# EasyEDA Pro project AC Power Switch.eprj, board PCB2
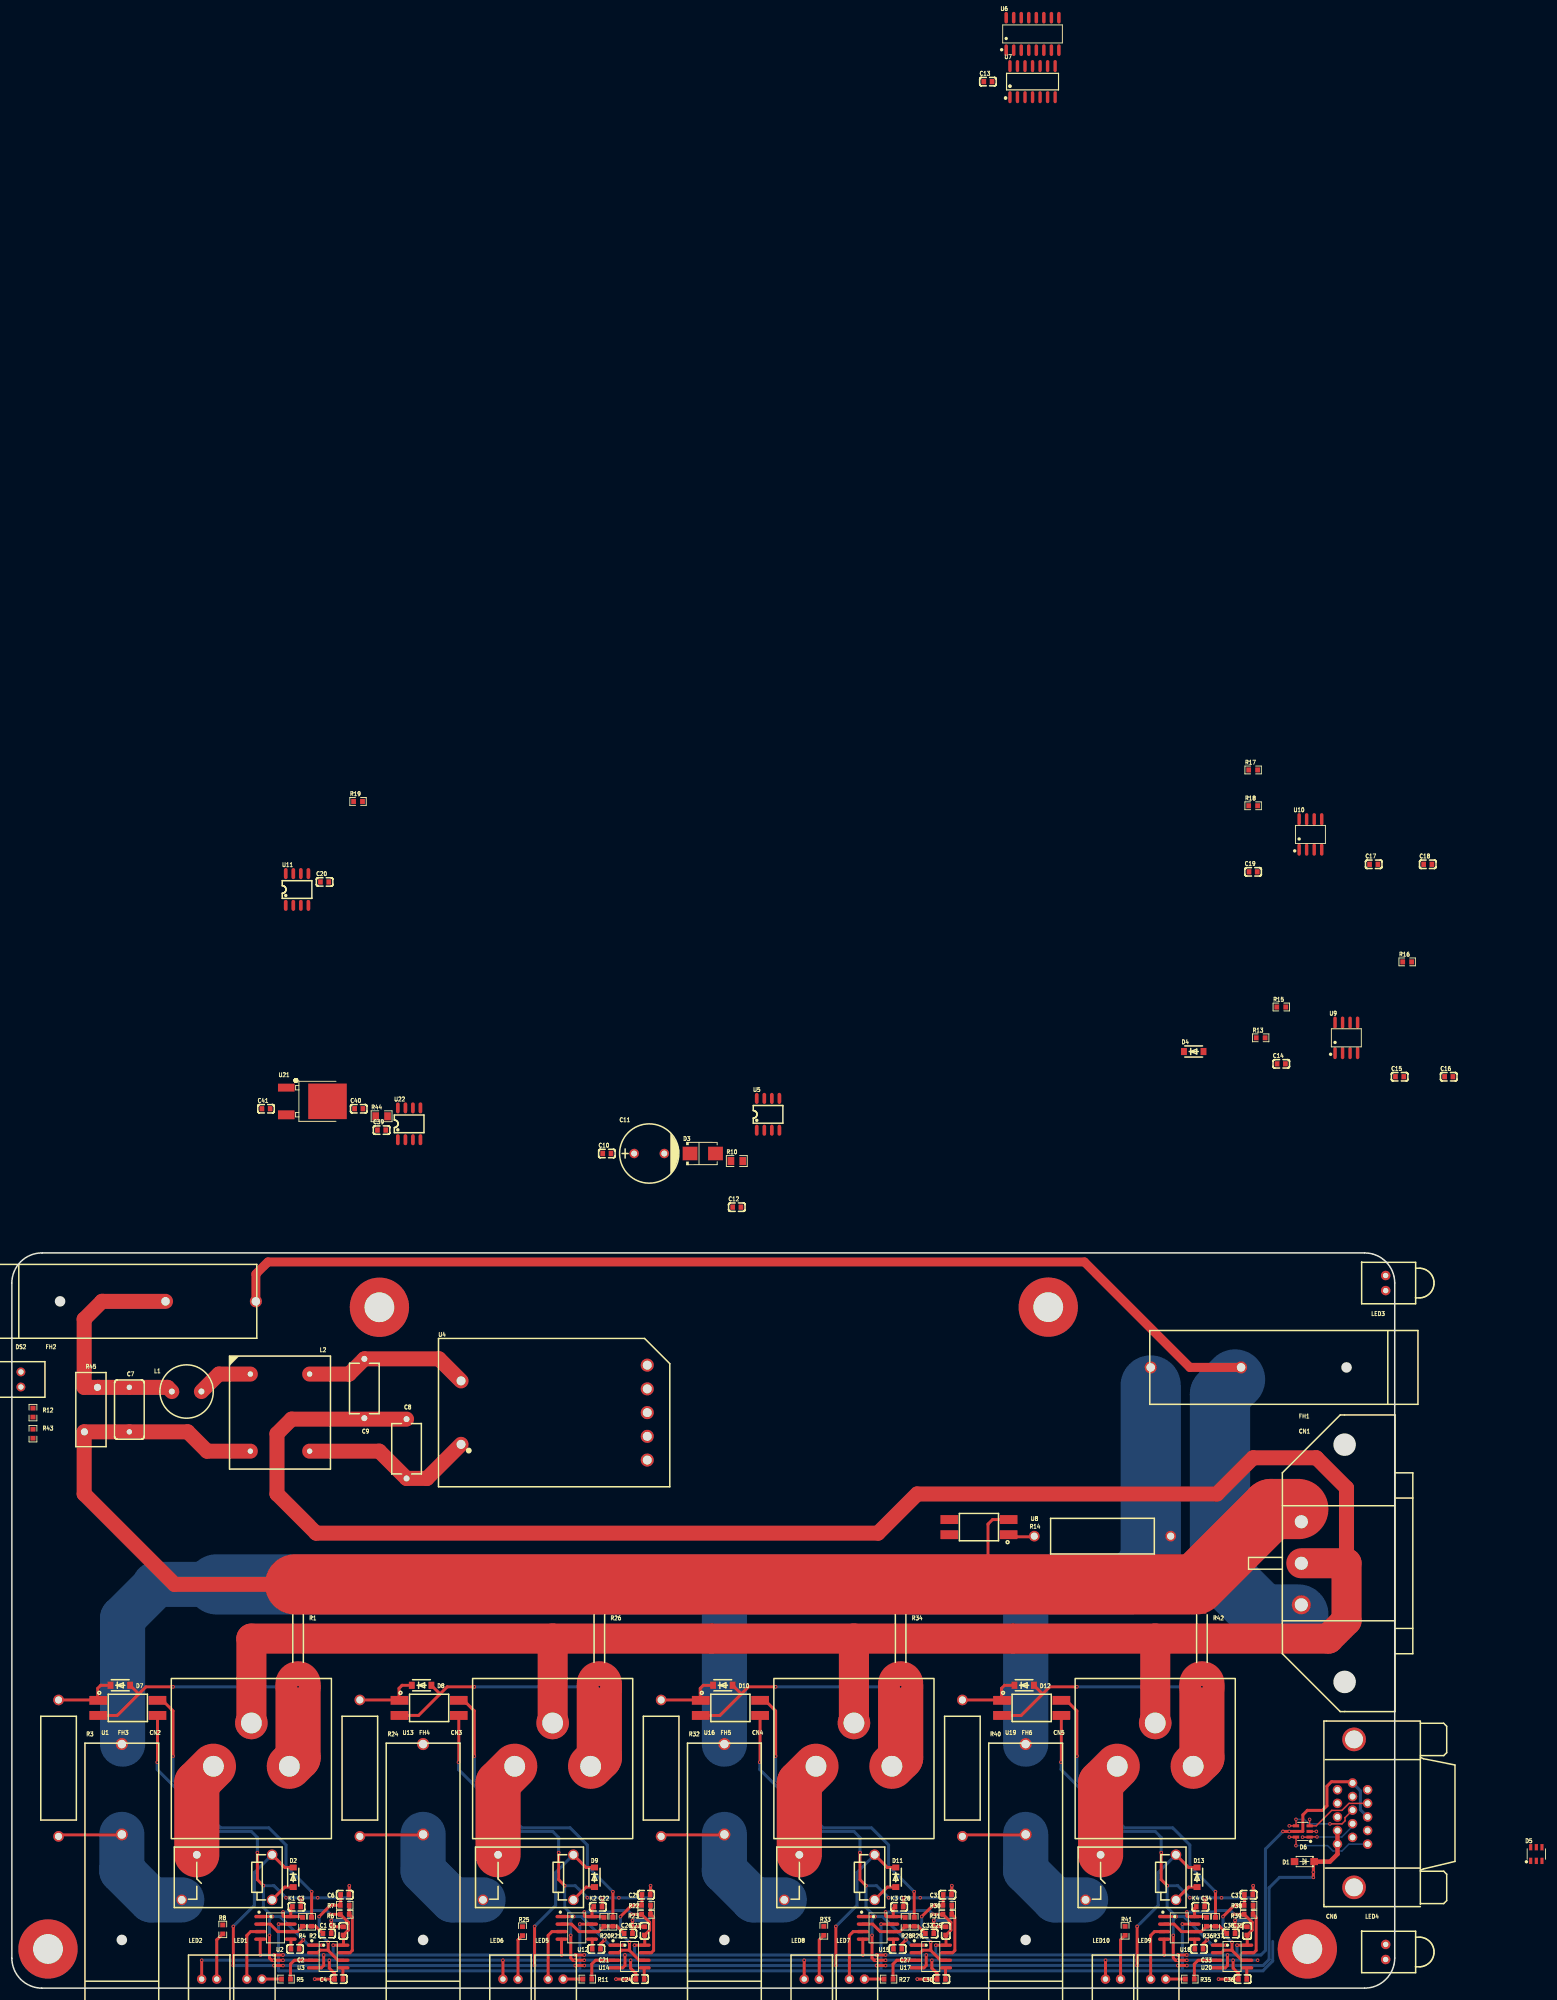
[diagram p7: board, top side]
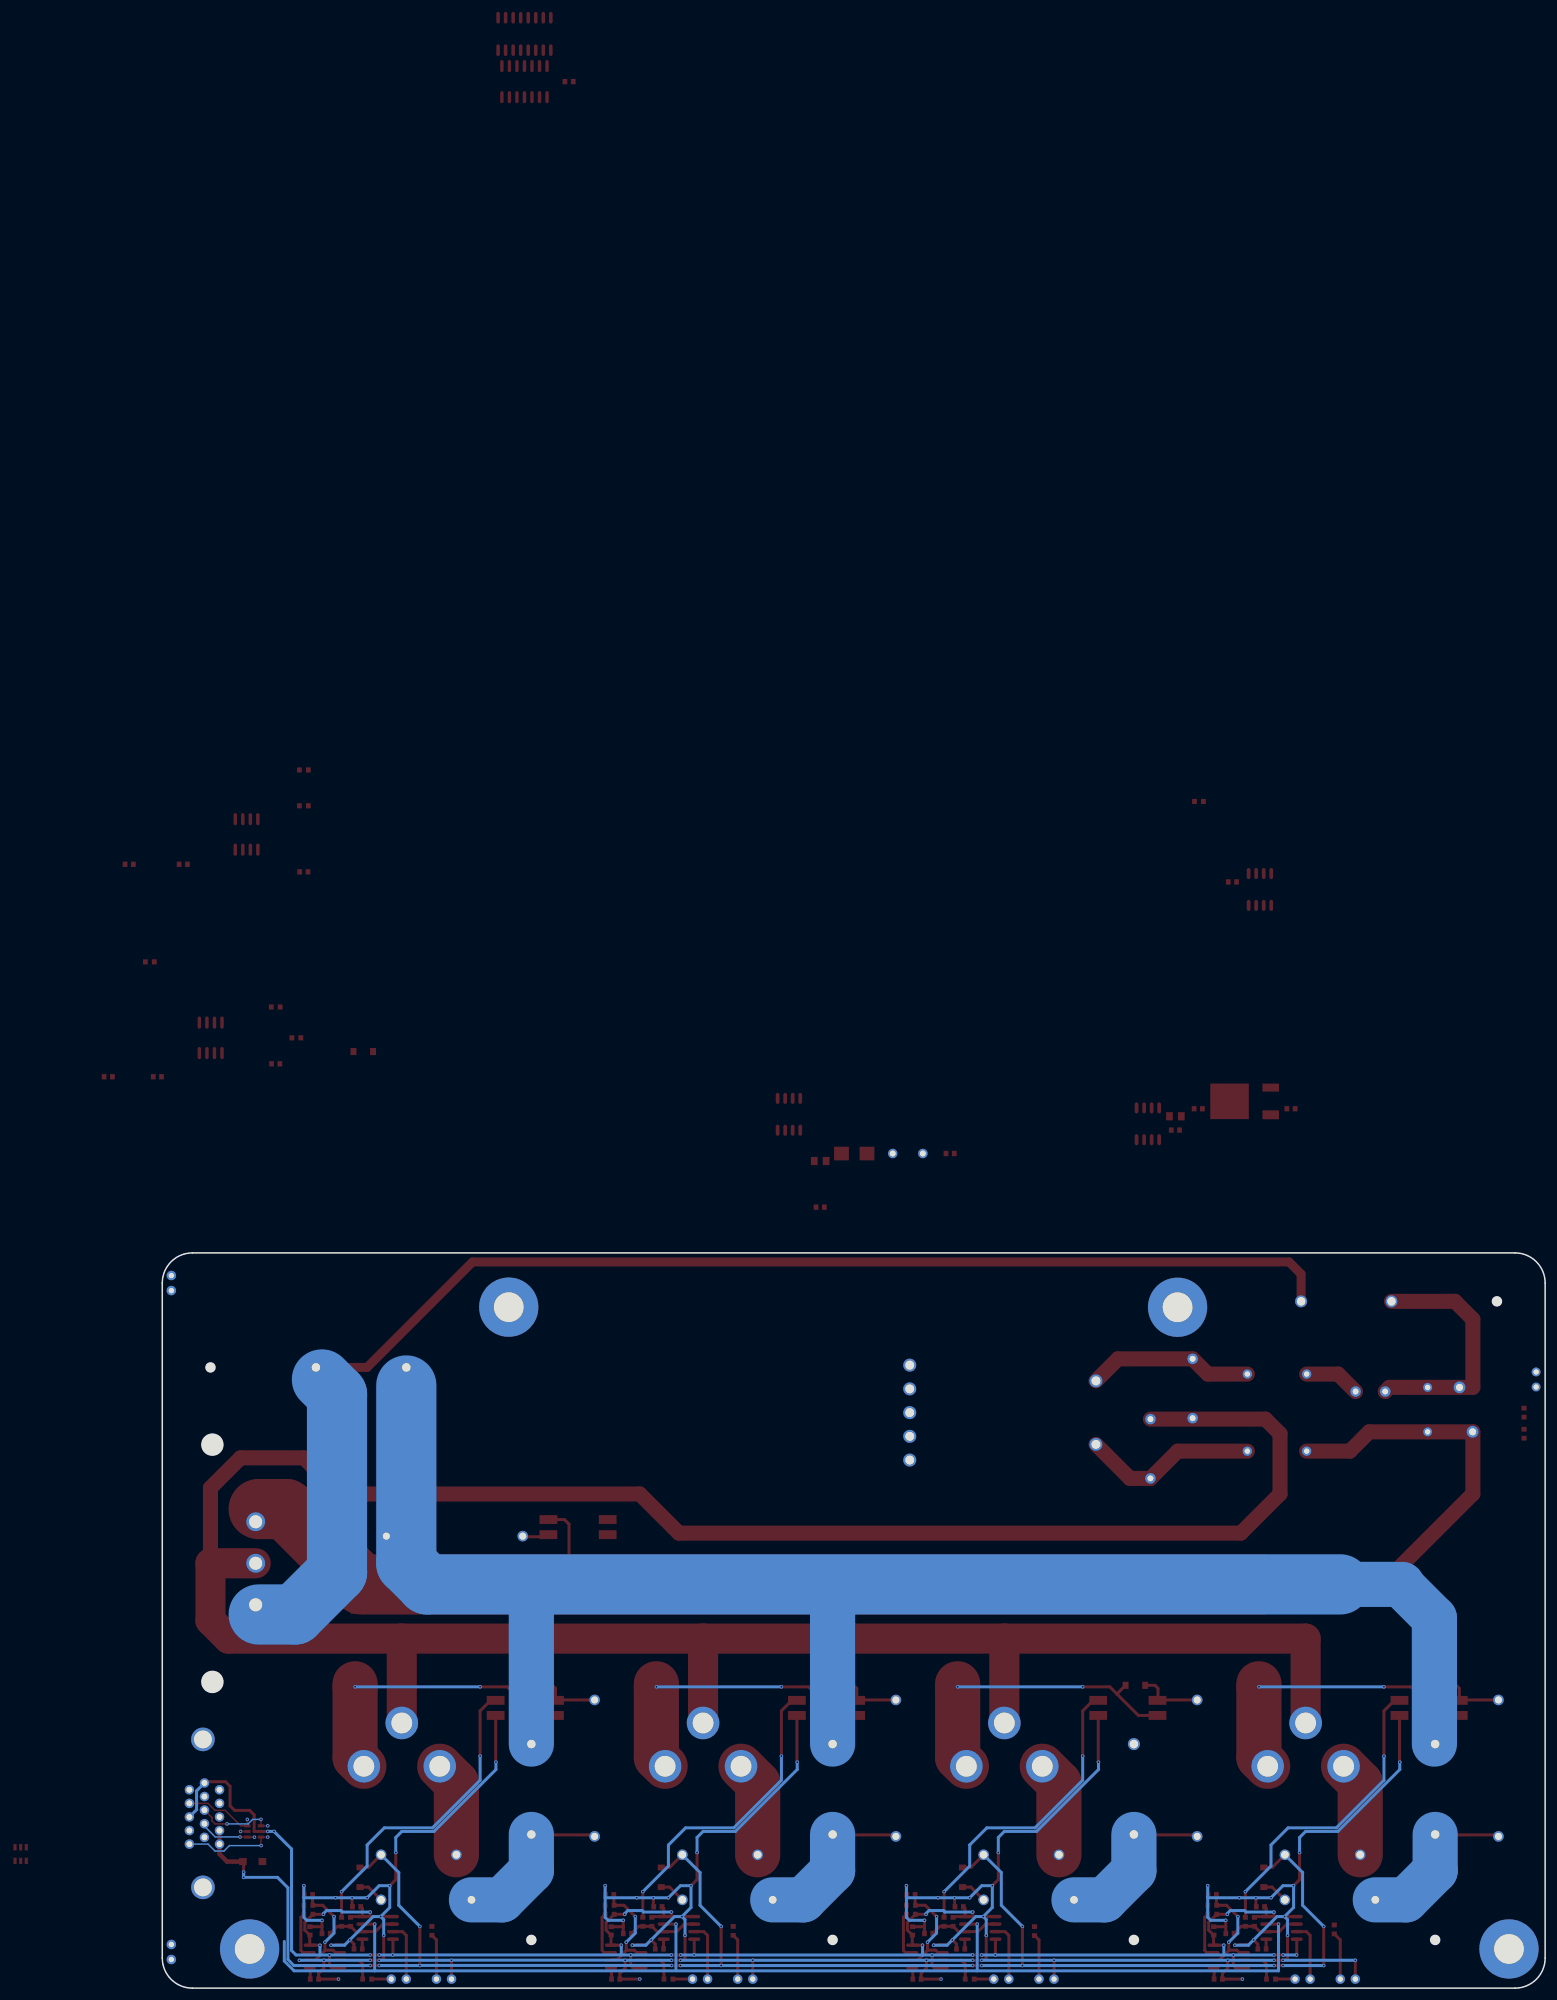
[diagram p8: board, bottom side, seen from below]

Outline 233.17 x 123.95 mm; copper layers: Top Layer, Bottom Layer. Coordinates in mm from the lower left corner of the outline.
Outline path: 0,118.87 0,5.08 arc(1.49,1.49) 5.08,0 228.09,0 arc(231.68,1.49) 233.17,5.08 233.17,118.87 arc(231.68,122.46) 228.09,123.95 5.08,123.95 arc(1.49,122.46) 0,118.87
Stack: Top Layer 0.035mm / Dielectric1 1.51mm FR4 er 4.5 / Bottom Layer 0.035mm

## Design rules (mm)
template: Custom Config
spacing copperThickness1oz (default): track to track 0.102, other pairs 0.152 to 0.3
spacing copperThickness2oz: track to track 0.203, other pairs 0.152 to 0.3
track width copperThickness1oz (default): min 0.127, default 0.254, max 10.16
track width copperThickness2oz: min 0.203, default 0.254, max 2.54
differential pair differentialPair (default): width min 0.127, default 0.254, max 2.54; gap min 0.152, default 0.152
via viaSize (default): diameter min 0.5, default 0.61, max 10; hole min 0.3, default 0.305, max 6.3

## Placement (name value [footprint] x y rotation side)
C1  -  [C0603]  53.15 9.21 180 top
C2  -  [C0603]  47.75 6.6 180 top
C3  -  [C0603]  48.01 13.72 180 top
C4  -  [C0603]  55.12 1.52 0 top
C5  -  [C0603]  55.88 9.65 270 top
C6  -  [C0603]  56.13 15.75 180 top
C7  100nF  [CAP-TH_L10.0-W5.0-P7.50-D0.6]  19.81 97.54 270 top
C8  1nF  [CAP-TH_L8.5-W5.0-P10.00-D0.6]  66.55 90.93 270 top
C9  1nF  [CAP-TH_L8.5-W5.0-P10.00-D0.6]  59.44 101.09 270 top
C10  1uF  [C0603]  100.33 140.71 0 top
C11  470uF  [CAP-TH_BD10.0-P5.00-D1.0-FD]  107.47 140.71 0 top
C12  100nF  [C0603]  122.24 131.67 0 top
C13  100nF  [C0603]  164.58 321.42 0 top
C14  10uF  [C0603]  214.04 155.83 0 top
C15  100nF  [C0603]  234 153.66 0 top
C16  100nF  [C0603]  242.28 153.66 0 top
C17  100nF  [C0603]  229.63 189.47 0 top
C18  100nF  [C0603]  238.75 189.47 0 top
C19  10uF  [C0603]  209.3 188.2 0 top
C20  100nF  [C0603]  52.73 186.5 0 top
C21  -  [C0603]  98.55 6.6 180 top
C22  -  [C0603]  98.81 13.72 180 top
C23  -  [C0603]  106.68 9.65 270 top
C24  -  [C0603]  105.92 1.52 0 top
C25  -  [C0603]  106.93 15.75 180 top
C26  -  [C0603]  103.95 9.21 180 top
C27  -  [C0603]  149.35 6.6 180 top
C28  -  [C0603]  149.61 13.72 180 top
C29  -  [C0603]  157.48 9.65 270 top
C30  -  [C0603]  156.72 1.52 0 top
C31  -  [C0603]  157.73 15.75 180 top
C32  -  [C0603]  154.75 9.21 180 top
C33  -  [C0603]  200.15 6.6 180 top
C34  -  [C0603]  200.41 13.72 180 top
C35  -  [C0603]  208.28 9.65 270 top
C36  -  [C0603]  207.52 1.52 0 top
C37  -  [C0603]  208.53 15.75 180 top
C38  -  [C0603]  205.55 9.21 180 top
C39  100nF  [C0603]  62.34 144.66 0 top
C40  100nF  [C0603]  58.49 148.26 0 top
C41  1uF  [C0603]  42.85 148.26 0 top
CN1  IEC-EW-4  [CONN-TH_IEC-EW-4]  217.42 71.63 270 top
CN2  -  [739W-X2/32]  40.39 44.7 0 top
CN3  -  [739W-X2/32]  91.19 44.7 0 top
CN4  -  [739W-X2/32]  141.99 44.7 0 top
CN5  -  [739W-X2/32]  192.79 44.7 0 top
CN6  DS1038-15FBNSiA74-0CC  [DSUB-TH_DS1038-15FBNSIA74-0CC]  226.06 29.46 90 top
D1  SMF12A  [SOD-123FL_L2.8-W1.8-LS3.8-R-RD]  217.93 21.34 180 top
D2  -  [SOD-123F_L2.8-W1.8-LS3.7-RD]  47.44 18.69 270 top
D3  SMBJ15A  [SMB_L4.3-W3.6-LS5.3-RD]  116.5 140.71 0 top
D4  SM4007PL  [SOD-123F_L2.8-W1.8-LS3.7-RD]  199.28 157.9 0 top
D5  SRV05-4  [SOT-23-6_L2.9-W1.6-P0.95-LS2.8-BL]  257.05 22.61 0 top
D6  SRV05-4  [SOT-23-6_L2.9-W1.6-P0.95-LS2.8-BL]  217.68 26.42 90 top
D7  -  [SOD-123F_L2.8-W1.8-LS3.7-RD]  18.29 51.05 0 top
D8  -  [SOD-123F_L2.8-W1.8-LS3.7-RD]  69.09 51.05 0 top
D9  -  [SOD-123F_L2.8-W1.8-LS3.7-RD]  98.24 18.69 270 top
D10  -  [SOD-123F_L2.8-W1.8-LS3.7-RD]  119.89 51.05 0 top
D11  -  [SOD-123F_L2.8-W1.8-LS3.7-RD]  149.04 18.69 270 top
D12  -  [SOD-123F_L2.8-W1.8-LS3.7-RD]  170.69 51.05 0 top
D13  -  [SOD-123F_L2.8-W1.8-LS3.7-RD]  199.84 18.69 270 top
DS2  MHK1560UGBTD  [LED-TH_MHK1560UGBTD]  1.52 102.62 270 top
FH1  -  [03450101H]  199.64 104.65 180 top
FH2  -  [03450101H]  33.53 115.79 0 top
FH3  -  [03450101H]  18.54 33.53 90 top
FH4  -  [03450101H]  69.34 33.53 90 top
FH5  -  [03450101H]  120.14 33.53 90 top
FH6  -  [03450101H]  170.94 33.53 90 top
K1  -  [RELAY-TH_QLRELAY_JZC-11FH-XXX-1H1L]  36.26 18.69 180 top
K2  -  [RELAY-TH_QLRELAY_JZC-11FH-XXX-1H1L]  87.06 18.69 180 top
K3  -  [RELAY-TH_QLRELAY_JZC-11FH-XXX-1H1L]  137.86 18.69 180 top
K4  -  [RELAY-TH_QLRELAY_JZC-11FH-XXX-1H1L]  188.66 18.69 180 top
L1  470uH  [IND-TH_BD9.0-P5.00-D0.7]  29.46 100.58 0 top
L2  YDUU10.5-253L0321  [IND-TH_4P-L19.0-W17.0]  45.21 97.03 270 top
LED1  -  [LED-TH_L12.2-W6.0-P2.54]  40.89 1.52 0 top
LED2  -  [LED-TH_L12.2-W6.0-P2.54]  33.27 1.52 0 top
LED3  MHK1560CRBTD  [LED-TH_L12.2-W6.0-P2.54]  231.65 118.87 90 top
LED4  MHK1560CRBTD  [LED-TH_L12.2-W6.0-P2.54]  231.65 6.1 90 top
LED5  -  [LED-TH_L12.2-W6.0-P2.54]  91.69 1.52 0 top
LED6  -  [LED-TH_L12.2-W6.0-P2.54]  84.07 1.52 0 top
LED7  -  [LED-TH_L12.2-W6.0-P2.54]  142.49 1.52 0 top
LED8  -  [LED-TH_L12.2-W6.0-P2.54]  134.87 1.52 0 top
LED9  -  [LED-TH_L12.2-W6.0-P2.54]  193.29 1.52 0 top
LED10  -  [LED-TH_L12.2-W6.0-P2.54]  185.67 1.52 0 top
NOREF  -  [Pad_e1205]  6.1 6.6 0 top
NOREF#2  -  [Pad_e1190]  174.75 114.81 0 top
NOREF#3  -  [Pad_e1191]  61.98 114.79 0 top
NOREF#4  -  [Pad_e1171]  218.44 6.6 0 top
R1  -  [RES-SMD_L10.2-W1.5_HOTCU-10.2D-0R]  48.26 58.93 270 top
R2  -  [R0603]  50.55 11.18 270 top
R3  -  [RES-TH_BD6.0-L17.5-P21.50-D0.8]  7.87 37.08 270 top
R4  -  [R0603]  49.02 11.18 90 top
R5  -  [R0603]  46.23 1.52 0 top
R6  -  [R0603]  56.13 12.45 180 top
R7  -  [R0603]  56.13 13.97 0 top
R8  -  [R0603]  35.56 9.9 90 top
R10  390Ω  [R0805]  122.24 139.44 0 top
R11  -  [R0603]  97.03 1.52 0 top
R12  1kΩ  [R0603]  3.56 97.03 90 top
R13  100Ω  [R0603]  210.57 160.21 0 top
R14  33kΩ  [RES-TH_BD6.0-L17.5-P21.50-D0.8]  183.9 76.2 0 top
R15  4.7kΩ  [R0603]  214.04 165.41 0 top
R16  1kΩ  [R0603]  235.27 173.02 0 top
R17  10kΩ  [R0603]  209.3 205.37 0 top
R18  20kΩ  [R0603]  209.3 199.34 0 top
R19  1kΩ  [R0603]  58.37 200.07 0 top
R20  -  [R0603]  99.82 11.18 90 top
R21  -  [R0603]  101.35 11.18 270 top
R22  -  [R0603]  106.93 13.97 0 top
R23  -  [R0603]  106.93 12.45 180 top
R24  -  [RES-TH_BD6.0-L17.5-P21.50-D0.8]  58.67 37.08 270 top
R25  -  [R0603]  86.1 9.61 90 top
R26  -  [RES-SMD_L10.2-W1.5_HOTCU-10.2D-0R]  99.06 58.93 270 top
R27  -  [R0603]  147.83 1.52 0 top
R28  -  [R0603]  150.62 11.18 90 top
R29  -  [R0603]  152.15 11.18 270 top
R30  -  [R0603]  157.73 13.97 0 top
R31  -  [R0603]  157.73 12.45 180 top
R32  -  [RES-TH_BD6.0-L17.5-P21.50-D0.8]  109.47 37.08 270 top
R33  -  [R0603]  136.91 9.65 90 top
R34  -  [RES-SMD_L10.2-W1.5_HOTCU-10.2D-0R]  149.86 58.93 270 top
R35  -  [R0603]  198.63 1.52 0 top
R36  -  [R0603]  201.42 11.18 90 top
R37  -  [R0603]  202.95 11.18 270 top
R38  -  [R0603]  208.53 13.97 0 top
R39  -  [R0603]  208.53 12.45 180 top
R40  -  [RES-TH_BD6.0-L17.5-P21.50-D0.8]  160.27 37.08 270 top
R41  -  [R0603]  187.71 9.65 90 top
R42  -  [RES-SMD_L10.2-W1.5_HOTCU-10.2D-0R]  200.66 58.93 270 top
R43  1kΩ  [R0603]  3.56 93.47 90 top
R44  390Ω  [R0805]  62.34 146.99 0 top
R45  210pF@1kHz  [RES-TH_L12.5-W5.1-P7.50-D1.2-S2.20]  13.34 97.54 270 top
U1  -  [OPTO-SMD-4_L4.6-W6.5-P2.54-LS10.3-BL]  19.56 47.24 270 top
U2  -  [SOIC-8_L4.9-W3.9-P1.27-LS6.0-BL]  44.45 10.16 270 top
U3  -  [SOIC-8_L4.9-W3.9-P1.27-LS6.0-BL]  53.34 5.33 270 top
U4  TAS20-12-W2  [PWRM-TH_4P-L39.0-W25.0_TAS12-15-W2]  91.44 97.03 0 top
U5  MX5052S  [SOP-8_L4.9-W3.9-P1.27-LS6.0-BL]  127.51 147.32 0 top
U6  ULN2003ADR  [SOIC-16_L9.9-W3.9-P1.27-LS6.0-BL]  172.1 329.46 0 top
U7  74HC08D,653  [SOIC-14_L8.7-W3.9-P1.27-LS6.0-BL]  172.1 321.42 0 top
U8  LTV-817S-TA1-C  [OPTO-SMD-4_L4.6-W6.5-P2.54-LS10.3-BL]  163.07 77.72 90 top
U9  NE555DR  [SOIC-8_L4.9-W3.9-P1.27-LS6.0-BL]  225.01 160.21 0 top
U10  NE555DR  [SOIC-8_L4.9-W3.9-P1.27-LS6.0-BL]  218.96 194.51 0 top
U11  DS18B20Z(UMW)  [SOP-8_L4.9-W3.9-P1.27-LS6.0-BL]  48.09 185.23 0 top
U12  -  [SOIC-8_L4.9-W3.9-P1.27-LS6.0-BL]  95.25 10.16 270 top
U13  -  [OPTO-SMD-4_L4.6-W6.5-P2.54-LS10.3-BL]  70.36 47.24 270 top
U14  -  [SOIC-8_L4.9-W3.9-P1.27-LS6.0-BL]  104.14 5.33 270 top
U15  -  [SOIC-8_L4.9-W3.9-P1.27-LS6.0-BL]  146.05 10.16 270 top
U16  -  [OPTO-SMD-4_L4.6-W6.5-P2.54-LS10.3-BL]  121.16 47.24 270 top
U17  -  [SOIC-8_L4.9-W3.9-P1.27-LS6.0-BL]  154.94 5.33 270 top
U18  -  [SOIC-8_L4.9-W3.9-P1.27-LS6.0-BL]  196.85 10.16 270 top
U19  -  [OPTO-SMD-4_L4.6-W6.5-P2.54-LS10.3-BL]  171.96 47.24 270 top
U20  -  [SOIC-8_L4.9-W3.9-P1.27-LS6.0-BL]  205.74 5.33 270 top
U21  -  [TO-252-2_L6.5-W6.1-P4.58-LS10.0-TL]  49.75 149.53 0 top
U22  MX5052S  [SOP-8_L4.9-W3.9-P1.27-LS6.0-BL]  66.99 145.72 0 top

## Footprints (pads in the part's own frame, mm; a bottom-side part is the same pattern mirrored in y, then rotated)
739W-X2/32
  round 5.5 hole 3.5: 1(6.4,-7.3) 2(-6.4,-7.3) 3(0,0)
03450101H
  round 2.032 hole 1.423: 1(7.62,0) 2(-7.62,0)
C0603
  rect 0.8x0.9 smd: 1(-0.7,0) 2(0.7,0)
CAP-TH_BD10.0-P5.00-D1.0-FD
  round 1.6 hole 1: 1(-2.54,0) 2(2.54,0)
CAP-TH_L8.5-W5.0-P10.00-D0.6
  round 1.8 hole 1: 1(-5,0) 2(5,0)
CAP-TH_L10.0-W5.0-P7.50-D0.6
  round 1.524 hole 0.9: 1(-3.75,0) 2(3.75,0)
CONN-TH_IEC-EW-4
  round 3.2 hole 2.2: 1(-7,0) 2(0,0) 3(7,0)
DSUB-TH_DS1038-15FBNSIA74-0CC
  round 1.6 hole 1: 1(3.978,2.54) 2(1.688,2.54) 3(-0.603,2.54) 4(-2.893,2.54) 5(-5.182,2.54) 6(5.128,0) 7(2.837,0) 8(0.548,0) 9(-1.743,0) 10(-4.042,0) 11(3.978,-2.54) 12(1.688,-2.54) 13(-0.603,-2.54) 14(-2.893,-2.54) 15(-5.182,-2.54)
  round 4 hole 3: 16(12.473,-0.254) 17(-12.473,-0.254)
IND-TH_4P-L19.0-W17.0
  round 1.6 hole 0.9: 1(-6.5,-5) 2(6.5,-5) 3(-6.5,5) 4(6.5,5)
IND-TH_BD9.0-P5.00-D0.7
  round 1.8 hole 1: 1(-2.5,0) 2(2.5,0)
LED-TH_L12.2-W6.0-P2.54
  round 1.6 hole 0.9: 1(-1.27,0) 2(1.27,0)
LED-TH_MHK1560UGBTD
  round 1.5 hole 0.9: 1(1.27,0) 2(-1.27,0)
OPTO-SMD-4_L4.6-W6.5-P2.54-LS10.3-BL
  rect 1.5x3 smd: 1(-1.27,-5) 2(1.27,-5) 3(1.27,5) 4(-1.27,5)
Pad_e1171
  round 10 hole 5: 1(0,0)
Pad_e1190
  round 10 hole 5: 1(0,0)
Pad_e1191
  round 10 hole 5: 1(0,0)
Pad_e1205
  round 10 hole 5: 1(0,0)
PWRM-TH_4P-L39.0-W25.0_TAS12-15-W2
  round 2.2 hole 1.5: 1(-15.7,-5.35) 2(-15.7,5.35) 3(15.7,8) 4(15.7,4) 5(15.7,0) 6(15.7,-4) 7(15.7,-8)
R0603
  rect 0.806x0.864 smd: 1(-0.753,0) 2(0.753,0)
R0805
  rect 1.133x1.377 smd: 1(-1,0) 2(1,0)
RELAY-TH_QLRELAY_JZC-11FH-XXX-1H1L
  round 1.8 hole 1.3: 1(-7.62,-3.8) 2(-7.62,3.8) 3(7.62,3.8) 4(5.08,-3.8)
RES-SMD_L10.2-W1.5_HOTCU-10.2D-0R
  rect 1.7x1.5 smd: 1(-5.05,0) 2(5.05,0)
RES-TH_BD6.0-L17.5-P21.50-D0.8
  round 1.8 hole 1.2: 1(-11.5,0) 2(11.5,0)
RES-TH_L12.5-W5.1-P7.50-D1.2-S2.20
  round 2 hole 1.2: 1(-3.749,1.1) 2(3.749,-1.1)
SMB_L4.3-W3.6-LS5.3-RD
  rect 2.5x2.3 smd: 1(-2.15,0) 2(2.15,0)
SOD-123F_L2.8-W1.8-LS3.7-RD
  rect 1x1.2 smd: 1(-1.65,0) 2(1.65,0)
SOD-123FL_L2.8-W1.8-LS3.8-R-RD
  rect 1.3x1.2 smd: 1(1.65,0) 2(-1.65,0)
SOIC-8_L4.9-W3.9-P1.27-LS6.0-BL
  oval 0.588x2.045 smd: 1(-1.905,-2.57) 2(-0.635,-2.57) 3(0.635,-2.57) 4(1.905,-2.57) 5(1.905,2.57) 6(0.635,2.57) 7(-0.635,2.57) 8(-1.905,2.57)
SOIC-14_L8.7-W3.9-P1.27-LS6.0-BL
  oval 0.574x2.038 smd: 1(-3.81,-2.619) 2(-2.54,-2.619) 3(-1.27,-2.619) 4(0,-2.619) 5(1.27,-2.619) 6(2.54,-2.619) 7(3.81,-2.619) 8(3.81,2.619) 9(2.54,2.619) 10(1.27,2.619) 11(0,2.619) 12(-1.27,2.619) 13(-2.54,2.619) 14(-3.81,2.619)
SOIC-16_L9.9-W3.9-P1.27-LS6.0-BL
  oval 0.602x1.971 smd: 1(-4.445,-2.736) 2(-3.175,-2.736) 3(-1.905,-2.736) 4(-0.635,-2.736) 5(0.635,-2.736) 6(1.905,-2.736) 7(3.175,-2.736) 8(4.445,-2.736) 9(4.445,2.736) 10(3.175,2.736) 11(1.905,2.736) 12(0.635,2.736) 13(-0.635,2.736) 14(-1.905,2.736) 15(-3.175,2.736) 16(-4.445,2.736)
SOP-8_L4.9-W3.9-P1.27-LS6.0-BL
  oval 0.63x1.865 smd: 1(-1.905,-2.683) 2(-0.635,-2.683) 3(0.635,-2.683) 4(1.905,-2.683) 5(1.905,2.683) 6(0.635,2.683) 7(-0.635,2.683) 8(-1.905,2.683)
SOT-23-6_L2.9-W1.6-P0.95-LS2.8-BL
  rect 0.532x1.072 smd: 1(-0.95,-1.149) 2(0,-1.149) 3(0.95,-1.149) 4(0.95,1.149) 5(0,1.149) 6(-0.95,1.149)
TO-252-2_L6.5-W6.1-P4.58-LS10.0-TL
  rect 2.799x1.351 smd: 1(-3.474,2.291)
  rect 2.799x1.501 smd: 3(-3.474,-2.291)
  rect 6.5x6 smd: 4(3.474,-0.018)

## Nets
+5V: C3.2 C5.2 C13.2 C20.2 C22.2 C23.2 C28.2 C29.2 C34.2 C35.2 CN6.6 CN6.13 D5.5 D6.5 R4.2 R6.2 R19.2 R20.2 R23.2 R28.2 R31.2 R36.2 R39.2 U2.4 U2.8 U3.4 U3.8 U7.14 U11.3 U12.4 U12.8 U14.4 U14.8 U15.4 U15.8 U17.4 U17.8 U18.4 U18.8 U20.4 U20.8 U22.5 U22.6 U22.7 U22.8
+12V: C41.2 CN6.4 CN6.5 D1.2 D2.1 D9.1 D11.1 D13.1 K1.1 K2.1 K3.1 K4.1 R43.1 U5.5 U5.6 U5.7 U5.8 U6.9 U21.1
GND: C1.1 C2.1 C3.1 C4.1 C5.1 C6.1 C10.1 C11.2 C12.1 C13.1 C14.1 C15.1 C16.1 C17.1 C18.1 C19.1 C20.1 C21.1 C22.1 C23.1 C24.1 C25.1 C26.1 C27.1 C28.1 C29.1 C30.1 C31.1 C32.1 C33.1 C34.1 C35.1 C36.1 C37.1 C38.1 C39.1 C40.1 C41.1 CN6.3 CN6.10 CN6.11 CN6.14 D1.1 D3.2 D5.2 D6.2 DS2.1 LED2.1 LED6.1 LED8.1 LED10.1 U1.3 U2.1 U3.1 U4.4 U5.2 U6.6 U6.7 U6.8 U7.7 U8.3 U9.1 U10.1 U11.5 U12.1 U13.3 U14.1 U15.1 U16.3 U17.1 U18.1 U19.3 U20.1 U21.4 U22.2
VCC: C16.2 C18.2 R15.2 R17.2 U9.4 U9.8 U10.4 U10.8
$2I1129\$1N254: CN2.2 K1.4
$2I1129\$1N1155: C2.2 U2.5
$2I1129\$1N1159: C1.2 R2.2 R4.1 U2.2 U2.6
$2I1129\$1N1161: LED1.1 U2.3
$2I1129\$1N1162: LED1.2 R5.1
$2I1129\$1N1169: C4.2 U3.5
$2I1129\$1N1170: C6.2 R7.1 U3.2 U3.6
$2I1129\$1N1173: R2.1 U1.4
$2I1129\$1N1174: R5.2 U3.3
$2I1129\$1N1176: R6.1 R7.2 U3.7
$2I1129\$1N1181: D7.1 R3.1 U1.1
$2I1129\$1N3824: LED2.2 R8.1
$2I1129\DET-RTN: CN2.1 D7.2 R1.2 U1.2
$2I1129\FUSE-DET: FH3.2 K1.3 R3.2
$2I1167\$1N254: CN3.2 K2.4
$2I1167\$1N1155: C21.2 U12.5
$2I1167\$1N1159: C26.2 R20.1 R21.2 U12.2 U12.6
$2I1167\$1N1161: LED5.1 U12.3
$2I1167\$1N1162: LED5.2 R11.1
$2I1167\$1N1169: C24.2 U14.5
$2I1167\$1N1170: C25.2 R22.1 U14.2 U14.6
$2I1167\$1N1173: R21.1 U13.4
$2I1167\$1N1174: R11.2 U14.3
$2I1167\$1N1176: R22.2 R23.1 U14.7
$2I1167\$1N1181: D8.1 R24.1 U13.1
$2I1167\$1N3824: LED6.2 R25.1
$2I1167\DET-RTN: CN3.1 D8.2 R26.2 U13.2
$2I1167\FUSE-DET: FH4.2 K2.3 R24.2
$2I1205\$1N254: CN4.2 K3.4
$2I1205\$1N1155: C27.2 U15.5
$2I1205\$1N1159: C32.2 R28.1 R29.2 U15.2 U15.6
$2I1205\$1N1161: LED7.1 U15.3
$2I1205\$1N1162: LED7.2 R27.1
$2I1205\$1N1169: C30.2 U17.5
$2I1205\$1N1170: C31.2 R30.1 U17.2 U17.6
$2I1205\$1N1173: R29.1 U16.4
$2I1205\$1N1174: R27.2 U17.3
$2I1205\$1N1176: R30.2 R31.1 U17.7
$2I1205\$1N1181: D10.1 R32.1 U16.1
$2I1205\$1N3824: LED8.2 R33.1
$2I1205\DET-RTN: CN4.1 D10.2 R34.2 U16.2
$2I1205\FUSE-DET: FH5.2 K3.3 R32.2
$2I1243\$1N254: CN5.2 K4.4
$2I1243\$1N1155: C33.2 U18.5
$2I1243\$1N1159: C38.2 R36.1 R37.2 U18.2 U18.6
$2I1243\$1N1161: LED9.1 U18.3
$2I1243\$1N1162: LED9.2 R35.1
$2I1243\$1N1169: C36.2 U20.5
$2I1243\$1N1170: C37.2 R38.1 U20.2 U20.6
$2I1243\$1N1173: R37.1 U19.4
$2I1243\$1N1174: R35.2 U20.3
$2I1243\$1N1176: R38.2 R39.1 U20.7
$2I1243\$1N1181: D12.1 R40.1 U19.1
$2I1243\$1N3824: LED10.2 R41.1
$2I1243\DET-RTN: CN5.1 D12.2 R42.2 U19.2
$2I1243\FUSE-DET: FH6.2 K4.3 R40.2
ACCESS: CN6.1 D5.4 U6.5 U7.2 U7.5 U7.10 U7.13
ACCESS-LED: LED4.1 U6.12
BUSIO1: CN6.8 D6.4 R8.2 U7.1
BUSIO2: CN6.9 D6.1 R25.2 U7.4
BUSIO3: CN6.12 D6.3 R33.2 U7.9
BUSIO4: CN6.15 D6.6 R41.2 U7.12
EARTH: C8.1 C9.2 CN1.2 CN2.3 CN3.3 CN4.3 CN5.3
INTERRUPT: CN6.7 D5.3 U2.7 U9.7 U12.7 U15.7 U18.7
LIVE: FH1.1 FH3.1 FH4.1 FH5.1 FH6.1 R14.2
LIVE-DC: CN1.3 FH1.2 FH2.1
NEUTRAL: C7.2 CN1.1 D4.2 L2.2 R1.1 R26.1 R34.1 R42.1 R45.2 U8.2
ONEWIRE: CN6.2 D5.6 U11.4
SIGNAL1: U6.1 U7.3
SIGNAL2: U6.2 U7.6
SIGNAL3: U6.3 U7.8
SIGNAL4: U6.4 U7.11
SWITCH1: D2.2 K1.2 U6.16
SWITCH2: D9.2 K2.2 U6.15
SWITCH3: D11.2 K3.2 U6.14
SWITCH4: D13.2 K4.2 U6.13
$1N921: C10.2 C11.1 D3.1 R10.2 U4.6 U5.3 U5.4
$1N923: C9.1 L2.3 U4.2
$1N926: C12.2 R10.1 U5.1
$1N928: DS2.2 R12.2
$1N930: C8.2 L2.4 U4.1
$1N932: L1.2 L2.1
$1N933: C7.1 FH2.2 L1.1 R45.1
$1N2322: R13.1 U8.4
$1N2324: D4.1 R14.1 U8.1
$1N2329: C15.2 U9.5
$1N2332: R16.2 U10.3
$1N2333: C17.2 U10.5
$1N2336: LED3.2 R16.1
$1N2337: LED3.1 U9.3
$1N2343: C14.2 R13.2 R15.1 U9.2 U9.6
$1N2344: C19.2 R18.1 U10.2 U10.6
$1N2346: R17.1 R18.2 U10.7
$1N3488: LED4.2 R19.1
$1N6490: R12.1 R43.2
$2N4049: C40.2 R44.2 U21.3 U22.3 U22.4
$2N4050: C39.2 R44.1 U22.1

Pads without a net: CN6 16 17; D5 1; NOREF 1; NOREF#2 1; NOREF#3 1; NOREF#4 1; U4 3 5 7; U6 10 11; U11 1 2 6 7 8

## Via types
v1: diameter 0.61, hole 0.305, Top Layer to Bottom Layer, 154 vias

## Routing (per net, layer and track width the routed paths; a pad name or vN(x,y) marks a point on that pad's centre or on a via; arc(x,y) is an arc through that point)
+5V: length 344.8
  Top Layer w0.508: U15.4 143.48,5.62 v1(143.51,5.59) ; v1(104.98,7.24) U14.8 106.71,8.92 C23.2 106.7,8.95 107.54,9.78 107.54,11.09 R23.2 v1(104.39,12.45) ; C22.2 97.82,13.43 U12.8 ; R20.2 99.69,12.07 U12.8 ; v1(54.18,7.24) U3.8 55.91,8.92 C5.2 55.9,8.95 56.74,9.78 56.74,11.09 R6.2 v1(53.59,12.45) ; v1(205.99,12.45) R39.2 209.14,11.09 209.14,9.78 208.3,8.95 C35.2 208.31,8.92 U20.8 v1(206.58,7.24) ; v1(41.91,5.59) 41.88,5.62 U2.4 ; R36.2 201.29,12.07 U18.8 ; U18.8 198.25,12.07 198.12,12.19 v1(198.12,12.83) ; U18.8 199.42,13.43 C34.2 ; v1(145.8,5.59) v1(147.32,5.59) ; U12.8 96.65,12.07 96.52,12.19 v1(96.52,12.83) ; U2.8 47.02,13.43 C3.2 ; U2.8 45.85,12.07 45.72,12.19 v1(45.72,12.83) ; U2.8 48.89,12.07 R4.2 ; C28.2 148.62,13.43 U15.8 ; R28.2 150.49,12.07 U15.8 ; U20.4 204.6,3.43 204.98,3.81 v1(204.98,5.59) ; v1(155.78,7.24) U17.8 157.51,8.92 C29.2 157.5,8.95 158.34,9.78 158.34,11.09 R31.2 v1(155.19,12.45) ; U17.4 153.8,3.43 154.18,3.81 v1(154.18,5.59) ; U15.8 147.45,12.07 147.32,12.19 v1(147.32,12.83) ; v1(103.38,5.59) 103.38,3.81 103,3.43 U14.4 ; CN6.6 225.85,34.8 222.5,34.8 221.74,34.04 221.74,30.73 220.98,29.97 218.44,29.97 217.68,29.21 217.68,26.42 D6.5 v1(215.39,26.42) v1(214.33,26.42) ; U12.4 92.68,5.62 v1(92.71,5.59) ; v1(196.6,5.59) v1(198.12,5.59) ; v1(194.31,5.59) 194.28,5.62 U18.4 ; v1(52.58,5.59) 52.58,3.81 52.2,3.43 U3.4 ; v1(44.2,5.59) v1(45.72,5.59) ; v1(95,5.59) v1(96.52,5.59)
  Bottom Layer w0.508: v1(198.12,5.59) v1(204.98,5.59) 206.58,5.59 ; v1(96.52,5.59) v1(103.38,5.59) 104.98,5.59 ; 104.98,5.59 v1(143.51,5.59) v1(145.8,5.59) ; 104.98,5.59 v1(104.98,7.24) ; v1(147.32,5.59) v1(154.18,5.59) 155.78,5.59 v1(155.78,7.24) ; 54.18,5.59 v1(52.58,5.59) v1(45.72,5.59) ; 54.18,5.59 v1(92.71,5.59) v1(95,5.59) ; 54.18,5.59 v1(54.18,7.24) ; v1(45.72,12.83) 50.42,12.83 50.67,13.08 53.09,13.08 53.59,12.57 v1(53.59,12.45) ; v1(198.12,12.83) 202.82,12.83 203.07,13.08 205.49,13.08 205.99,12.57 v1(205.99,12.45) ; v1(41.91,5.59) v1(44.2,5.59) ; 194.06,5.6 156.05,5.6 156.03,5.59 ; v1(147.32,12.83) 152.02,12.83 152.27,13.08 154.69,13.08 155.19,12.57 v1(155.19,12.45) ; v1(104.39,12.45) 104.39,12.57 103.89,13.08 101.47,13.08 101.22,12.83 v1(96.52,12.83) ; v1(215.39,26.42) v1(214.33,26.42) 211.38,23.47 211.38,6.35 210.62,5.59 206.58,5.59 ; CN6.13 227.38,30.08 227.38,33.27 CN6.6 ; v1(194.31,5.59) v1(196.6,5.59) ; 206.58,5.59 v1(206.58,7.24)
+12V: length 310.2
  Top Layer w0.508: D13.1 198.43,20.34 K4.1 ; D11.1 147.63,20.34 K3.1 ; D1.2 219.46,21.21 v1(219.46,19.56) v1(219.46,18.67) ; v1(96.52,3.81) v1(95,3.81) ; D9.1 96.83,20.34 K2.1 ; D2.1 46.03,20.34 K1.1 ; v1(37.34,10.41) v1(37.34,3.81) ; v1(189.74,10.41) v1(189.74,3.81) ; v1(198.12,3.81) v1(196.6,3.81) ; v1(45.72,3.81) v1(44.2,3.81) ; v1(147.32,3.81) v1(145.8,3.81) ; v1(138.94,10.41) v1(138.94,3.81) ; v1(88.14,10.41) v1(88.14,3.81)
  Top Layer w0.762: D1.2 222.25,21.34 223.52,22.61 CN6.5 CN6.4
  Bottom Layer w0.508: v1(45.72,3.81) v1(88.14,3.81) v1(95,3.81) ; v1(96.52,3.81) v1(138.94,3.81) v1(145.8,3.81) ; K4.1 193.29,19.5 193.29,13.96 v1(189.74,10.41) ; v1(88.14,10.41) 91.69,13.96 91.69,19.5 K2.1 ; v1(37.34,10.41) 40.89,13.96 40.89,19.5 K1.1 ; v1(219.46,19.56) v1(219.46,18.67) 213.74,18.67 211.99,16.92 211.99,4.82 210.97,3.81 v1(198.12,3.81) ; v1(37.34,3.81) v1(44.2,3.81) ; 189.48,3.82 147.59,3.82 147.57,3.81 ; v1(189.74,3.81) v1(196.6,3.81) ; v1(138.94,10.41) 142.49,13.96 142.49,19.5 K3.1
GND: length 620.4
  Top Layer w0.254: D6.2 v1(219.96,26.42)
  Top Layer w0.508: C22.1 99.57,13.78 v1(99.57,15.24) ; v1(209.3,17.27) 209.3,15.81 C37.1 ; v1(42.42,17.27) 41.4,18.29 v1(41.4,22.86) ; v1(104.65,11.43) 104.65,10.35 ; 104.65,10.35 C26.1 ; 104.65,10.35 C23.1 ; v1(155.45,11.43) 155.45,10.35 ; 155.45,10.35 C29.1 ; 155.45,10.35 C32.1 ; 53.85,10.35 C1.1 ; 53.85,10.35 C5.1 ; 53.85,10.35 v1(53.85,11.43) ; v1(203.45,1.52) C36.1 206.82,2.48 205.93,3.37 v1(205.93,4.7) ; LED6.1 v1(82.8,4.7) ; v1(53.53,4.7) 53.53,3.37 54.42,2.48 C4.1 v1(51.05,1.52) ; v1(101.85,1.52) C24.1 105.22,2.48 104.32,3.37 v1(104.32,4.7) ; v1(147.32,4.7) v1(145.8,4.7) 145.41,4.7 145.03,5.08 v1(145.03,8.89) ; v1(99.95,8.13) 99.25,7.43 C21.1 ; v1(150.37,15.24) 150.37,13.78 C28.1 ; v1(153.92,7.24) U17.1 ; C2.1 48.45,7.43 v1(49.15,8.13) ; C33.1 200.85,7.43 v1(201.55,8.13) ; LED10.1 v1(184.4,4.7) ; C25.1 107.7,15.81 v1(107.7,17.27) ; v1(158.5,17.27) 158.5,15.81 C31.1 ; v1(94.23,8.89) 94.23,5.08 94.62,4.7 v1(95,4.7) v1(96.52,4.7) ; v1(75.31,38.1) 75.36,38.15 U13.3 ; v1(103.12,7.24) U14.1 ; C3.1 48.77,13.78 v1(48.77,15.24) ; v1(150.75,8.13) 150.05,7.43 C27.1 ; v1(152.65,1.52) C30.1 156.02,2.48 155.12,3.37 v1(155.12,4.7) ; v1(206.25,11.43) 206.25,10.35 ; 206.25,10.35 C35.1 ; 206.25,10.35 C38.1 ; U16.3 126.16,38.15 v1(126.11,38.1) ; v1(52.32,7.24) U3.1 ; C34.1 201.17,13.78 v1(201.17,15.24) ; v1(43.94,12.07) U2.1 ; U1.3 24.56,38.15 v1(24.51,38.1) ; v1(56.9,17.27) 56.9,15.81 C6.1 ; LED8.1 v1(133.6,4.7) ; v1(204.72,7.24) U20.1 ; v1(45.72,4.7) v1(44.2,4.7) 43.81,4.7 43.43,5.08 v1(43.43,8.89) ; v1(196.34,12.07) U18.1 ; v1(144.02,17.27) 143,18.29 v1(143,22.86) ; v1(93.22,17.27) 92.2,18.29 v1(92.2,22.86) ; LED2.1 v1(32,4.7) ; v1(194.82,17.27) 193.8,18.29 v1(193.8,22.86) ; v1(176.91,38.1) 176.96,38.15 U19.3 ; v1(195.83,8.89) 195.83,5.08 196.22,4.7 v1(196.6,4.7) v1(198.12,4.7) ; v1(94.74,12.07) U12.1 ; v1(145.54,12.07) U15.1
  Bottom Layer w0.508: v1(206.25,11.43) 208.79,11.43 209.3,11.94 209.3,15.24 ; v1(193.8,22.86) 193.8,25.4 192.79,26.42 187.35,26.42 176.91,36.86 v1(176.91,38.1) ; 184.15,4.71 155.39,4.71 155.38,4.7 ; v1(43.94,12.07) 43.43,11.56 v1(43.43,8.89) ; v1(43.94,12.07) 45.21,12.07 v1(49.15,8.13) 50.04,7.24 v1(52.32,7.24) ; v1(43.94,12.07) 42.42,13.59 v1(42.42,17.27) 44.2,17.27 v1(46.23,15.24) v1(48.77,15.24) v1(51.56,15.24) 56.9,15.24 ; v1(145.54,12.07) 144.02,13.59 v1(144.02,17.27) 145.8,17.27 v1(147.83,15.24) v1(150.37,15.24) v1(153.16,15.24) 158.5,15.24 ; v1(145.54,12.07) 145.03,11.56 v1(145.03,8.89) ; v1(145.54,12.07) 146.81,12.07 v1(150.75,8.13) 151.64,7.24 v1(153.92,7.24) ; v1(103.12,7.24) 100.84,7.24 v1(99.95,8.13) 96.01,12.07 v1(94.74,12.07) ; 56.9,15.24 56.9,11.94 56.39,11.43 v1(53.85,11.43) ; 56.9,15.24 v1(56.9,17.27) ; v1(94.23,8.89) 94.23,11.56 v1(94.74,12.07) ; v1(196.34,12.07) 195.83,11.56 v1(195.83,8.89) ; v1(196.34,12.07) 197.61,12.07 v1(201.55,8.13) 202.44,7.24 v1(204.72,7.24) ; v1(196.34,12.07) 194.82,13.59 v1(194.82,17.27) 196.6,17.27 v1(198.63,15.24) v1(201.17,15.24) v1(203.96,15.24) 209.3,15.24 ; 209.3,15.24 v1(209.3,17.27) ; v1(210.06,4.7) v1(205.93,4.7) v1(198.12,4.7) ; v1(104.65,11.43) 107.19,11.43 107.7,11.94 107.7,15.24 ; v1(94.74,12.07) 93.22,13.59 v1(93.22,17.27) 95,17.27 v1(97.03,15.24) v1(99.57,15.24) v1(102.36,15.24) 107.7,15.24 ; 158.5,15.24 v1(158.5,17.27) ; 158.5,15.24 158.5,11.94 157.99,11.43 v1(155.45,11.43) ; v1(143,22.86) 143,25.4 141.99,26.42 136.55,26.42 126.11,36.86 v1(126.11,38.1) ; v1(155.12,4.7) v1(147.32,4.7) ; v1(41.4,22.86) 41.4,25.4 40.39,26.42 34.95,26.42 24.51,36.86 v1(24.51,38.1) ; 107.7,15.24 v1(107.7,17.27) ; v1(45.72,4.7) v1(53.53,4.7) v1(82.8,4.7) v1(95,4.7) ; v1(44.2,4.7) v1(32,4.7) ; v1(92.2,22.86) 92.2,25.4 91.19,26.42 85.75,26.42 75.31,36.86 v1(75.31,38.1) ; v1(196.6,4.7) v1(184.4,4.7) ; v1(96.52,4.7) v1(104.32,4.7) v1(133.6,4.7) v1(145.8,4.7)
$2I1129\$1N254: length 16.1
  Top Layer w7.62: K1.4 31.18,34.6 CN2.2
$2I1129\$1N1155: length 1.7
  Top Layer w0.508: C2.2 47.05,8.22 U2.5
$2I1129\$1N1159: length 12.1
  Top Layer w0.508: R2.2 51.23,10.42 C1.2 ; R2.2 R4.1 48.12,9.53 44.83,9.53 43.56,10.8 U2.2 ; R2.2 50.48,10.36
$2I1129\$1N1161: length 9.9
  Top Layer w0.508: 41.88,9.53 40.26,9.53 39.62,8.89 LED1.1
$2I1129\$1N1162: length 3.3
  Top Layer w0.508: 45.48,1.52 45.47,1.53 42.17,1.53 LED1.2
$2I1129\$1N1169: length 1.9
  Top Layer w0.508: U3.5 55.82,3.34 C4.2
$2I1129\$1N1170: length 18.5
  Top Layer w0.508: 53.29,6.4 53.34,6.45 v1(53.34,7.75) ; 53.29,6.4 54.99,4.7 U3.6 ; 53.29,6.4 51.99,6.4 51.56,5.97 U3.2 ; v1(51.82,12.07) 53.72,13.97 R7.1 55.43,14.02 C6.2
  Bottom Layer w0.508: v1(53.34,7.75) 51.82,9.27 v1(51.82,12.07)
$2I1129\$1N1173: length 52.6
  Top Layer w0.508: v1(27.18,39.12) 27.18,46.74 25.4,48.51 U1.4 ; R2.1 v1(50.55,16.26)
  Bottom Layer w0.508: v1(27.18,39.12) 27.18,35.05 35.2,27.03 43.33,27.03 46.23,24.13 46.23,20.57 v1(50.55,16.26)
$2I1129\$1N1174: length 6.6
  Top Layer w0.508: U3.3 47.62,4.7 46.98,4.06 R5.2
$2I1129\$1N1176: length 9.5
  Top Layer w0.508: R7.2 R6.1 57.4,11.93 57.4,6.35 57.02,5.97 U3.7
$2I1129\$1N1181: length 11
  Top Layer w0.508: 14.49,48.58 14.48,48.59 14.48,50.55 14.99,51.05 D7.1 ; 14.49,48.58 R3.1 ; 14.49,48.58 U1.1
$2I1129\$1N3824: length 7.7
  Top Layer w0.508: LED2.2 34.54,8.14 35.31,8.9
$2I1129\DET-RTN: length 52.3
  Top Layer w0.508: 21.38,49.57 17.78,45.97 U1.2 ; 21.38,49.57 22.61,50.8 v1(27.18,50.8) ; 21.38,49.57 21.38,49.61 D7.2
  Top Layer w7.62: 48.26,51.31 v1(48.26,50.8) 48.26,38.88 CN2.1
  Bottom Layer w0.508: v1(27.18,50.8) v1(48.26,50.8)
$2I1129\FUSE-DET: length 28.9
  Top Layer w0.508: FH3.2 18.47,25.84 7.87,25.84
  Bottom Layer w7.62: K1.3 23.47,14.89 18.54,19.81 FH3.2
$2I1167\$1N254: length 16.1
  Top Layer w7.62: K2.4 81.98,34.6 CN3.2
$2I1167\$1N1155: length 1.7
  Top Layer w0.508: C21.2 97.85,8.22 U12.5
$2I1167\$1N1159: length 12.1
  Top Layer w0.508: R21.2 102.03,10.42 C26.2 ; R21.2 101.28,10.36 ; R21.2 R20.1 98.92,9.53 95.63,9.53 94.36,10.8 U12.2
$2I1167\$1N1161: length 9.9
  Top Layer w0.508: 92.68,9.53 91.06,9.53 90.42,8.89 LED5.1
$2I1167\$1N1162: length 3.3
  Top Layer w0.508: LED5.2 92.97,1.53 96.27,1.53 96.28,1.52
$2I1167\$1N1169: length 1.9
  Top Layer w0.508: U14.5 106.62,3.34 C24.2
$2I1167\$1N1170: length 18.5
  Top Layer w0.508: v1(104.14,7.75) 104.14,6.45 104.09,6.4 ; C25.2 106.23,14.02 R22.1 104.52,13.97 v1(102.62,12.07) ; U14.2 102.36,5.97 102.79,6.4 104.09,6.4 ; 104.09,6.4 105.79,4.7 U14.6
  Bottom Layer w0.508: v1(102.62,12.07) 102.62,9.27 v1(104.14,7.75)
$2I1167\$1N1173: length 52.6
  Top Layer w0.508: R21.1 v1(101.35,16.26) ; U13.4 76.2,48.51 77.98,46.74 v1(77.98,39.12)
  Bottom Layer w0.508: v1(101.35,16.26) 97.03,20.57 97.03,24.13 94.13,27.03 86,27.03 77.98,35.05 v1(77.98,39.12)
$2I1167\$1N1174: length 6.6
  Top Layer w0.508: R11.2 97.78,4.06 98.43,4.7 U14.3
$2I1167\$1N1176: length 9.5
  Top Layer w0.508: R22.2 R23.1 108.2,11.93 108.2,6.35 107.82,5.97 U14.7
$2I1167\$1N1181: length 11
  Top Layer w0.508: D8.1 65.79,51.05 65.28,50.55 65.28,48.59 65.29,48.58 ; 65.29,48.58 R24.1 ; 65.29,48.58 U13.1
$2I1167\$1N3824: length 7.7
  Top Layer w0.508: LED6.2 85.34,8.14 86.11,8.9
$2I1167\DET-RTN: length 52.3
  Top Layer w0.508: 72.18,49.57 72.18,49.61 D8.2 ; 72.18,49.57 73.41,50.8 v1(77.98,50.8) ; 72.18,49.57 68.58,45.97 U13.2
  Top Layer w7.62: CN3.1 99.06,38.88 v1(99.06,50.8) 99.06,51.31
  Bottom Layer w0.508: v1(77.98,50.8) v1(99.06,50.8)
$2I1167\FUSE-DET: length 28.9
  Top Layer w0.508: FH4.2 69.27,25.84 58.67,25.84
  Bottom Layer w7.62: K2.3 74.27,14.89 69.34,19.81 FH4.2
$2I1205\$1N254: length 16.1
  Top Layer w7.62: K3.4 132.78,34.6 CN4.2
$2I1205\$1N1155: length 1.7
  Top Layer w0.508: U15.5 148.65,8.22 C27.2
$2I1205\$1N1159: length 12.1
  Top Layer w0.508: R29.2 152.83,10.42 C32.2 ; R29.2 R28.1 149.72,9.53 146.43,9.53 145.16,10.8 U15.2 ; R29.2 152.08,10.36
$2I1205\$1N1161: length 9.9
  Top Layer w0.508: 143.48,9.53 141.86,9.53 141.22,8.89 LED7.1
$2I1205\$1N1162: length 3.3
  Top Layer w0.508: LED7.2 143.77,1.53 147.07,1.53 147.07,1.52
$2I1205\$1N1169: length 1.9
  Top Layer w0.508: U17.5 157.42,3.34 C30.2
$2I1205\$1N1170: length 18.5
  Top Layer w0.508: v1(154.94,7.75) 154.94,6.45 154.89,6.4 ; 154.89,6.4 153.59,6.4 153.16,5.97 U17.2 ; 154.89,6.4 156.59,4.7 U17.6 ; C31.2 157.03,14.02 R30.1 155.32,13.97 v1(153.42,12.07)
  Bottom Layer w0.508: v1(154.94,7.75) 153.42,9.27 v1(153.42,12.07)
$2I1205\$1N1173: length 52.6
  Top Layer w0.508: U16.4 127,48.51 128.78,46.74 v1(128.78,39.12) ; R29.1 v1(152.15,16.26)
  Bottom Layer w0.508: v1(152.15,16.26) 147.83,20.57 147.83,24.13 144.93,27.03 136.8,27.03 128.78,35.05 v1(128.78,39.12)
$2I1205\$1N1174: length 6.6
  Top Layer w0.508: U17.3 149.22,4.7 148.58,4.06 R27.2
$2I1205\$1N1176: length 9.5
  Top Layer w0.508: U17.7 158.62,5.97 159,6.35 159,11.93 R31.1 R30.2
$2I1205\$1N1181: length 11
  Top Layer w0.508: 116.09,48.58 116.08,48.59 116.08,50.55 116.59,51.05 D10.1 ; 116.09,48.58 R32.1 ; 116.09,48.58 U16.1
$2I1205\$1N3824: length 7.7
  Top Layer w0.508: R33.1 136.14,8.14 LED8.2
$2I1205\DET-RTN: length 52.3
  Top Layer w0.508: 122.98,49.57 119.38,45.97 U16.2 ; 122.98,49.57 122.98,49.61 D10.2 ; 122.98,49.57 124.21,50.8 v1(128.78,50.8)
  Top Layer w7.62: CN4.1 149.86,38.88 v1(149.86,50.8) 149.86,51.31
  Bottom Layer w0.508: v1(128.78,50.8) v1(149.86,50.8)
$2I1205\FUSE-DET: length 28.9
  Top Layer w0.508: FH5.2 120.07,25.84 109.47,25.84
  Bottom Layer w7.62: K3.3 125.07,14.89 120.14,19.81 FH5.2
$2I1243\$1N254: length 16.1
  Top Layer w7.62: CN5.2 183.58,34.6 K4.4
$2I1243\$1N1155: length 1.7
  Top Layer w0.508: C33.2 199.45,8.22 U18.5
$2I1243\$1N1159: length 12.1
  Top Layer w0.508: U18.2 195.96,10.8 197.23,9.53 200.52,9.53 R36.1 R37.2 ; R37.2 203.63,10.42 C38.2 ; R37.2 202.88,10.36
$2I1243\$1N1161: length 9.9
  Top Layer w0.508: LED9.1 192.02,8.89 192.66,9.53 194.28,9.53
$2I1243\$1N1162: length 3.3
  Top Layer w0.508: LED9.2 194.57,1.53 197.87,1.53 197.88,1.52
$2I1243\$1N1169: length 1.9
  Top Layer w0.508: C36.2 208.22,3.34 U20.5
$2I1243\$1N1170: length 18.5
  Top Layer w0.508: C37.2 207.83,14.02 R38.1 206.12,13.97 v1(204.22,12.07) ; v1(205.74,7.75) 205.74,6.45 205.69,6.4 ; U20.6 207.39,4.7 205.69,6.4 ; U20.2 203.96,5.97 204.39,6.4 205.69,6.4
  Bottom Layer w0.508: v1(204.22,12.07) 204.22,9.27 v1(205.74,7.75)
$2I1243\$1N1173: length 52.6
  Top Layer w0.508: v1(179.58,39.12) 179.58,46.74 177.8,48.51 U19.4 ; R37.1 v1(202.95,16.26)
  Bottom Layer w0.508: v1(179.58,39.12) 179.58,35.05 187.6,27.03 195.73,27.03 198.63,24.13 198.63,20.57 v1(202.95,16.26)
$2I1243\$1N1174: length 6.6
  Top Layer w0.508: U20.3 200.03,4.7 199.38,4.06 R35.2
$2I1243\$1N1176: length 9.5
  Top Layer w0.508: U20.7 209.42,5.97 209.8,6.35 209.8,11.93 R39.1 R38.2
$2I1243\$1N1181: length 11
  Top Layer w0.508: 166.89,48.58 166.88,48.59 166.88,50.55 167.39,51.05 D12.1 ; 166.89,48.58 U19.1 ; 166.89,48.58 R40.1
$2I1243\$1N3824: length 7.7
  Top Layer w0.508: R41.1 186.94,8.14 LED10.2
$2I1243\DET-RTN: length 52.3
  Top Layer w0.508: U19.2 170.18,45.97 173.78,49.57 ; 173.78,49.57 173.78,49.61 D12.2 ; 173.78,49.57 175.01,50.8 v1(179.58,50.8)
  Top Layer w7.62: 200.66,51.31 v1(200.66,50.8) 200.66,38.88 CN5.1
  Bottom Layer w0.508: v1(179.58,50.8) v1(200.66,50.8)
$2I1243\FUSE-DET: length 28.9
  Top Layer w0.508: FH6.2 170.87,25.84 160.27,25.84
  Bottom Layer w7.62: FH6.2 170.94,19.81 175.87,14.89 K4.3
BUSIO1: length 13.4
  Top Layer w0.254: v1(215.39,27.37) D6.4 v1(216.53,28.45) ; CN6.8 224.79,28.74 224.79,28.19 224.28,27.69 v1(222.25,27.69)
  Bottom Layer w0.254: v1(216.53,28.45) 217.93,28.45 218.69,27.69 v1(222.25,27.69)
BUSIO2: length 9.6
  Top Layer w0.254: v1(220.06,25.49) 218.85,25.49 D6.1 218.81,25.45 v1(217.63,25.45)
  Bottom Layer w0.254: 226.06,27.72 226.06,27.31 224.25,25.49 v1(220.06,25.49)
BUSIO3: length 12.4
  Top Layer w0.254: CN6.12 225.46,31.15 224.28,29.97 222.55,29.97 219.95,27.37 D6.3 v1(218.83,28.45)
BUSIO4: length 15.5
  Top Layer w0.254: v1(215.39,25.47) D6.6 216.53,25.46 216.53,24.05 v1(216.51,24.03)
  Bottom Layer w0.254: CN6.15 225.45,24.28 224.28,23.11 222.76,23.11 221.84,24.03 v1(216.51,24.03)
EARTH: length 495.2
  Top Layer w2.54: C8.1 47.16,95.93 44.7,93.47 44.7,83.31 51.31,76.71 146.05,76.71 152.65,83.31 203.2,83.31 209.3,89.41 219.96,89.41 225.04,84.33 225.04,72.14
  Top Layer w5.08: 117.86,58.93 91.19,58.93 ; 91.19,58.93 40.39,58.93 CN2.3 ; 91.19,58.93 CN3.3 ; 141.99,58.93 CN4.3 ; 141.99,58.93 168.66,58.93 ; 141.99,58.93 118.11,58.93 ; CN1.2 225.04,71.63 225.04,61.98 222,58.93 192.79,58.93 ; 192.79,58.93 168.91,58.93 ; 192.79,58.93 CN5.3
INTERRUPT: length 211.1
  Top Layer w0.508: U12.7 v1(95.76,10.8) ; U15.7 v1(146.56,10.8) ; U2.7 v1(44.96,10.8) ; U18.7 v1(197.36,10.8)
  Bottom Layer w0.508: 197.36,2.92 210.95,2.92 212.6,4.57 212.6,7.87 ; 197.36,2.92 v1(197.36,10.8) ; 197.36,2.92 146.81,2.92 ; 95.76,2.92 44.96,2.92 v1(44.96,10.8) ; 95.76,2.92 v1(95.76,10.8) ; 95.76,2.92 146.56,2.92 v1(146.56,10.8)
LIVE: length 279.6
  Bottom Layer w7.62: 24.13,68.07 34.54,68.07 ; FH6.1 170.94,66.8 ; FH5.1 120.14,66.8 ; 24.13,67.82 18.67,62.36 18.67,41.15
  Bottom Layer w10.16: 34.54,68.07 188.52,68.07 192.02,71.57 192.02,101.6
LIVE-DC: length 228.6
  Top Layer w1.524: FH2.1 41.15,120.4 43.18,122.43 180.85,122.43 198.63,104.65 FH1.2
  Bottom Layer w10.16: 206.25,102.62 203.71,100.08 203.71,70.1 210.82,62.99 216.92,62.99
NEUTRAL: length 265.5
  Top Layer w0.508: U8.2 165.35,78.99 164.59,78.23 164.59,71.63
  Top Layer w2.54: 19.81,93.79 12.19,93.79 12.19,83.31 27.43,68.07 47.75,68.07 ; L2.2 32.92,90.53 29.66,93.79 C7.2
  Top Layer w10.16: 199.65,68.07 212.35,80.77 216.92,80.77 ; 47.75,68.07 198.63,68.07
SWITCH1: length 4.4
  Top Layer w0.508: K1.2 46.03,17.04 47.44,17.04
SWITCH2: length 4.4
  Top Layer w0.508: 98.24,17.04 96.83,17.04 K2.2
SWITCH3: length 4.4
  Top Layer w0.508: 149.04,17.04 147.63,17.04 K3.2
SWITCH4: length 4.4
  Top Layer w0.508: 199.84,17.04 198.43,17.04 K4.2
$1N923: length 28.1
  Top Layer w2.54: U4.2 72.03,106.09 C9.1 56.87,103.53 L2.3
$1N930: length 29.8
  Top Layer w2.54: L2.4 61.95,90.53 C8.2 69.99,85.93 U4.1
$1N932: length 9.5
  Top Layer w2.54: L2.1 34.91,103.53 L1.2
$1N933: length 41.5
  Top Layer w2.54: 19.81,101.29 12.19,101.29 12.19,112.78 15.2,115.79 FH2.2 ; L1.1 26.26,101.29 C7.1
$1N2324: length 4.7
  Top Layer w0.508: 172.14,76.45 171.78,76.09 168.43,76.09 U8.1 ; 172.14,75.95 R14.1
